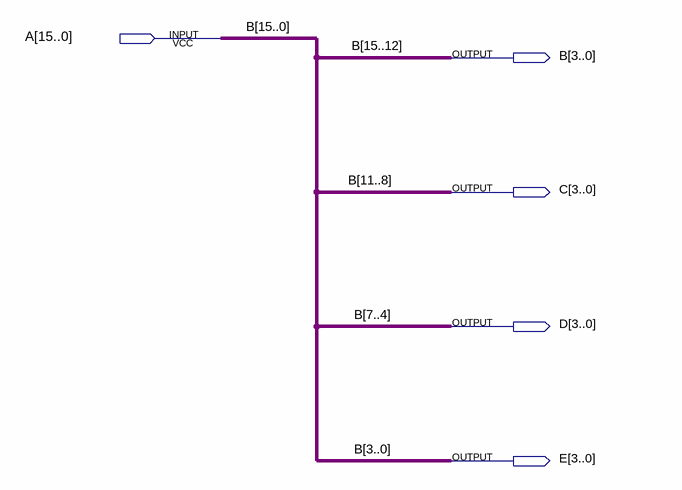
[diagram p0: schematic sheet]
// Quartus schematic bus16_bus4.bdf as structural Verilog: 0 symbols, 5 pins
module bus16_bus4 (
  input  [15:0] A,
  output [3:0] B,
  output [3:0] C,
  output [3:0] D,
  output [3:0] E
);


  assign A[3:0] = A[15:12];
  assign B = A[15:12];
  assign C = A[11:8];
  assign D = A[7:4];
  assign E = A[15:12];

  // Other names for the same wires on the sheet: B[15:4] = A[15:4]
endmodule
